# Altium schematic sheet Radar_Digital.SchDoc
size A; SheetNumber: 3; SheetTotal: 4
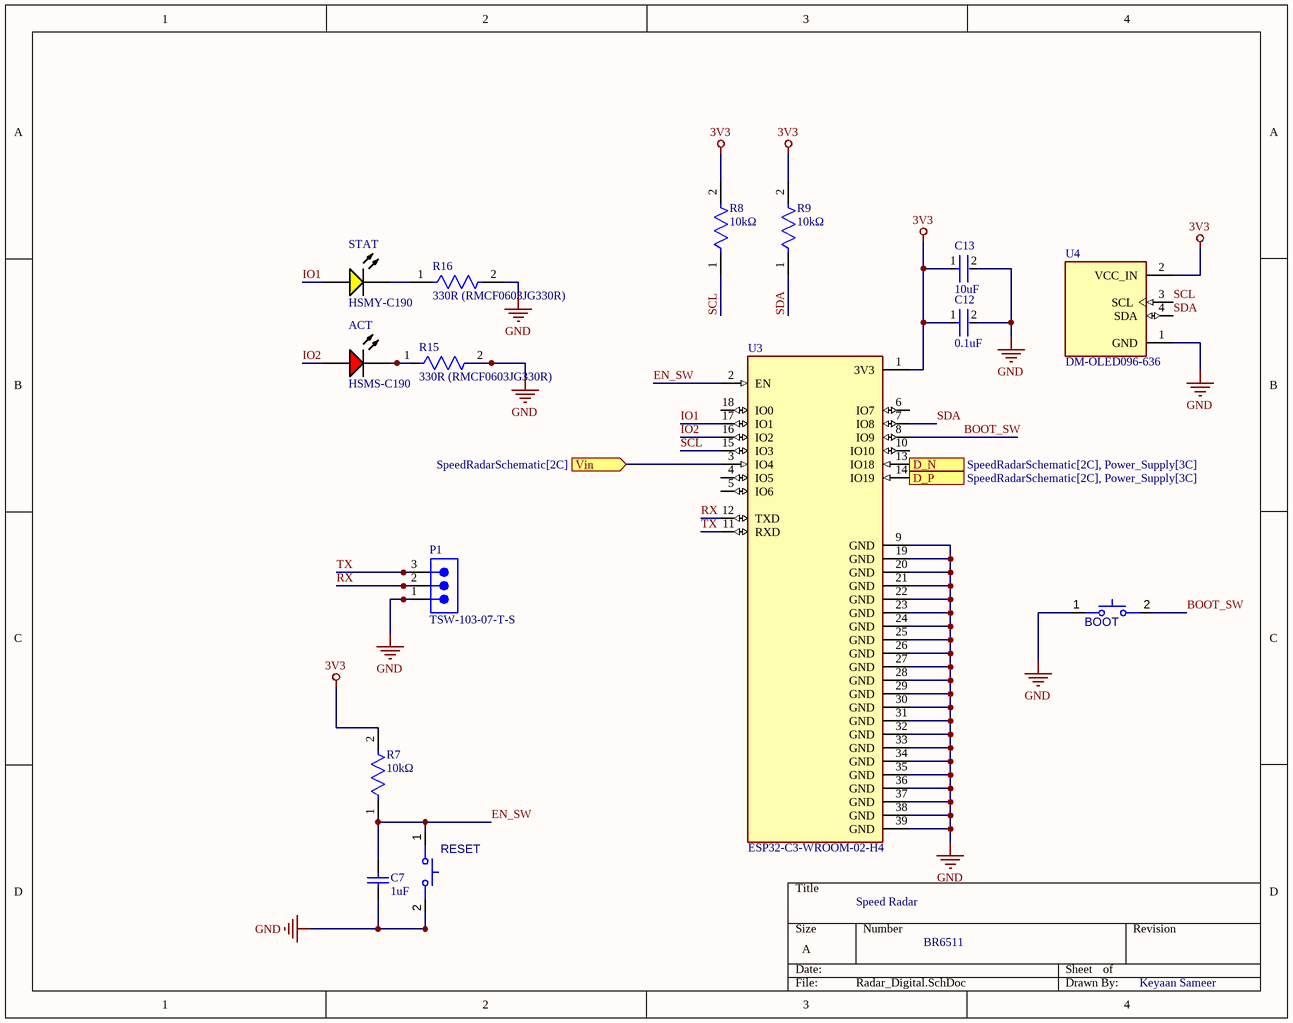
[diagram p0: Radar_Digital.SchDoc]

## Parts
ACT  HSMS-C190  [AVAG-HSMX-C190_V]
BOOT  B3U-1000P-B  [OMRON-B3U-1000P-2-B_V]  (value not drawn)
C7  1uF  [CAPC1608X90X35NL15T15]
C12  value 0.1uF  [FP-GCD21B-0_15-IPC_A]  (hidden comment: GCD21BR71H104KA01L)
C13  10uF  [FP-C0805C106K8RACAUTO-MFG]
P1  TSW-103-07-T-S  [SMTC-TSW-103-07-X-S]
R7  10kΩ  [FP-RQ732B-IPC_C]
R8  10kΩ  [FP-RQ732B-IPC_C]
R9  10kΩ  [FP-RQ732B-IPC_C]
R15  330R (RMCF0603JG330R)  [FP-RMCF0603-IPC_B]
R16  330R (RMCF0603JG330R)  [FP-RMCF0603-IPC_B]
RESET  B3U-1000P-B  [OMRON-B3U-1000P-2-B_V]  (value not drawn)
STAT  HSMY-C190  [AVAG-HSMX-C190_V]
U3  ESP32-C3-WROOM-02-H4  [MODULE_ESP32-C3-WROOM-02-H4]
U4  DM-OLED096-636  [MODULE_DM-OLED096-636]

## Ports
D_N (in, see SpeedRadarSchematic[2C], Power_Supply[3C]), D_P (in, see SpeedRadarSchematic[2C], Power_Supply[3C]), Vin (in, see SpeedRadarSchematic[2C])

## Nets
3V3: C12.1 C13.1 R7.2 R8.2 R9.2 U3.1(3V3) U4.2(VCC_IN)
GND: BOOT.1 C7.1 C12.2 C13.2 P1.1 R15.2 R16.2 RESET.2 U3.9(GND) U3.19(GND) U3.20(GND) U3.21(GND) U3.22(GND) U3.23(GND) U3.24(GND) U3.25(GND) U3.26(GND) U3.27(GND) U3.28(GND) U3.29(GND) U3.30(GND) U3.31(GND) U3.32(GND) U3.33(GND) U3.34(GND) U3.35(GND) U3.36(GND) U3.37(GND) U3.38(GND) U3.39(GND) U4.1(GND)
BOOT_SW: BOOT.2 U3.8(IO9)
D_N: U3.13(IO18) ; port D_N
D_P: U3.14(IO19) ; port D_P
EN_SW: C7.2 R7.1 RESET.1 U3.2(EN)
IO1: STAT.1(A) U3.17(IO1)
IO2: ACT.1(A) U3.16(IO2)
RX: P1.2 U3.12(TXD)
SCL: R8.1 U3.15(IO3) U4.3(SCL)
SDA: R9.1 U3.7(IO8) U4.4(SDA)
TX: P1.3 U3.11(RXD)
Vin: U3.3(IO4) ; port Vin
NetACT_2: ACT.2(K) R15.1
NetR16_1: R16.1 STAT.2(K)

Not connected (* = marked no-connect by the designer): U3 4(IO5) 5(IO6) 6(IO7) 10(IO10) 18(IO0)

## Notes on the sheet
- Speed Radar
- BR6511
- Keyaan Sameer

## Library data of the parts
ACT = CMP-2000-06427-1: LED Uni-Color Red, 52 mW, 20 mA, -40 to 85 degC, 2-Pin SMD, RoHS, Tape and Reel; Manufacturer: Avago; Reverse Voltage: 5V; Viewing Angle: 170deg; High Brightness: No; Lens Type: ColorlessDiffused; DELETED: Compliant; Product Height (mm): 0.8mm; Dominant Wave Length: 626nm; Number of  Elements: 1; Chip Material: GaP; Lum Intensity: 10mcd; Product Length (mm): 1.6mm; Forward Voltage: 2.6V; Power Dissipation: 52W; Shape Type: Rectangular; Forward Current: 25mA; Peak Wavelength: 630nm; Test Current (It): 20mA; Main Category: ChipLED; Lens Dimensions: 1x0.8x0.5mm; Pin Count: 2; Package Reference: HSMX-C190; Mounting Technology: SurfaceMount; Mounting: SurfaceMount; Datasheet URL: http://docs.avagotech.com/docs/AV02-0551EN; Package Type: ChipLed; Operating Temperature Classification: Industrial; Datasheet Version: 03/2012; Operating Temp Range: -40Cto85C; Emitting Color: Red; Rad Hardened: No; Manufacturer URL: http://www.avagotech.com/; Luminous Intensity: 10mcd; Package Description: 2-Pin Surface Mount Device, Body 1.6 x 0.8 mm, Height 0.9 mm; Type: Uni-Color; Packaging: TapeandReel; Product Depth (mm): 0.8mm
BOOT RESET = CMP-011-00011-3: Ultra-small Surface-mounting Tactile Switches with High Contact Reliability, SPST-NO, -25 to 70 degC, 2-Pin SMD, RoHS, Tape and Reel; Voltage Rating: 12V; Current Rating: 50mA; Pins: 2; RoHS Compliant: Details
C7 = CMP-2006-04534-1: Part Number: 0603YD105MAT2A; Manufacturer: AVX Interconnect / Elco
C12 = CMP-001-00087-1: Ceramic Capacitor, Multilayer, Ceramic, 50V, 10% +Tol, 10% -Tol, X7R, 15% TC, 0.1uF, Surface Mount, 0805; Case/Package: 0805; Mounting Technology: Surface Mount; Min Operating Temperature: -55°C; Capacitor Type: Ceramic; Pins: 2; RoHS Compliant: Yes; Max Operating Temperature: 125°C
C13 = CMP-03020-034662-1: CAP CER 10UF 10V X7R 0805; Tolerance: 10%; Case/Package: 0805; Ratings: AEC-Q200; Packaging: Tape and Reel; Voltage Rating: 10V; Max Operating Temperature: 125°C; Min Operating Temperature: -55°C; Case Code (Metric): 2012; Case Code (Imperial): 0805; Mount: Surface Mount; RoHS Compliant: Yes; Capacitance: 10uF
P1 = CMP-1024-00332-1: 0.025" SQ Post Header, Through-hole, Vertical, -55 to 105 degC, 2.54 mm Pitch, 3-Pin, Male, RoHS; Manufacturer: Samtec; Pitch: 2.54 mm; ComponentLink1URL: http://www.samtec.com; ComponentLink3URL: http://www.samtec.com/documents/webfiles/cpdf/TSW-XXX-XX-XXX-X-XX-XXX-MKT.pdf; PartNumber: TSW-103-07-T-S; Mounting Technology: Through-hole; RoHS: True; DatasheetVersion: F-214; PackageVersion: DM, 8/1988; Temperature Range: -55 to 105 degC; ComponentLink2Description: Datasheet; ComponentLink1Description: Manufacturer URL; Orientation: Vertical; PackageReference: TSW-103-07-X-S; ComponentLink3Description: Package Specification; ComponentLink2URL: http://www.samtec.com/documents/webfiles/pdf/TSW_TH.PDF; PackageDescription: .025[0.64] SQ. Post Terminal Strip Assembly
R7-R9 = CMP-03211-005393-1: RQ732B 1206 10KΩ 0.4W 10ppm/°C 0.1% 200V; Manufacturer: TE; Manufacturer Part Number: RQ73C2B10KBTD; Automotive Grade: Grade 0; ComponentLink2URL: https://www.te.com/commerce/DocumentDelivery/DDEController?Action=showdoc&DocId=Data+Sheet%7F1773270-2%7FA%7Fpdf%7FEnglish%7FENG_DS_1773270-2_A.pdf%7F9-2176388-464; Temperature Range Low: -55°C; Power Rating: 0.4W; Voltage Rating: 200V; RoHS: TRUE; ComponentLink2Description: Datasheet; Composition: Thin Film; Temperature Coefficient: 10ppm/°C; Height: 0.75mm; Ipc Land Pattern Name: RESC310160X60; Series: RQ73; Temperature: -55°C to +155°C; Package: RQ732B; Automotive: Yes; Category: Res; Octopart: https://octopart.com/rq73c2b10kbtd-te+connectivity-93910771; Resistance: 10KΩ; Lead Free: Yes; Temperature Range High: +155°C; Device Class L3: Chip SMD Resistors; Tolerance: 0.1%; Device Class L1: Passive Components; Value: 10KΩ; Device Class L2: Resistors
R15 R16 = CMP-26527-007473-1: 330Ω ±5% 0.1W 0603 Thick Film Chip Resistor AEC-Q200 compliant; Max Power Dissipation: 100mW; Temperature Coefficient: 200ppm/°C; Case/Package: 0603; Length: 0.061inch; Tolerance: 5%; Series: RMCF; Width: 0.031inch; Radiation Hardening: No; Packaging: Tape and Reel; Min Operating Temperature: -55°C; RoHS Compliant: Yes; Mount: Surface Mount; Resistor Type: Thick Film; Features: Automotive AEC-Q200; Resistance: 330R; Contact Plating: Tin; Number of Terminations: 2; Max Operating Temperature: 155°C; Height: 0.022inch
STAT = CMP-1744-00003-1: LED Uni-Color Yellow, 65 mW, 20 mA, -40 to 85 degC, 2-Pin SMD, RoHS, Tape and Reel; Tolerance: 1%; Voltage Rating: 50 V; Power Rating: 100 mW; Case\Package: 0603; Resistance: 390 Ohm; Min Operating Temperature: -55 degC; Length: 1.6 mm; ComponentLink3Description: Package Specification; Mount: Surface Mount; PackageReference: HSMX-C190; ComponentLink2Description: Datasheet; DatasheetVersion: Mar-12; Case Code (Metric): 1608; Pins: 2; Package Quantity: 5000; ComponentLink2URL: http://docs.avagotech.com/docs/AV02-0551EN; ComponentLink1Description: Manufacturer URL; RoHSCompliant: true; Packaging: Tape and Reel; PackageDescription: 2-Pin Surface Mount Device, Body 1.6 x 0.8 mm, Height 0.9 mm; REACH SVHC: No SVHC; ComponentLink3URL: http://www.fairchildsemi.com/dwg/MA/MA03D.pdf; Voltage Rating (DC): 50 V; Width: 0.8 mm; ComponentLink1URL: http://www.avagotech.com/; Max Operating Temperature: 155 degC; Case Code (Imperial): 0603; Height: 0.45 mm
U3 = ESP32-C3-WROOM-02-H4: WiFi Modules (802.11) (Engineering Samples) SMD module, ESP32-C3, 4MB SPI flash, PCB antenna, -40 C +105 C; MF: Espressif Systems; SnapEDA_Link: https://www.snapeda.com/parts/ESP32-C3-WROOM-02-H4/Espressif+Systems/view-part/?ref=snap; Package: Package; Value: *; MP: ESP32-C3-WROOM-02-H4; Check_prices: https://www.snapeda.com/parts/ESP32-C3-WROOM-02-H4/Espressif+Systems/view-part/?ref=eda
U4 = DM-OLED096-636: 0.96â€ 128 X 64 MONOCHROME GRAPHIC OLED DISPLAY MODULE - I2C; SnapEDA_Link: https://www.snapeda.com/parts/DM-OLED096-636/Display+Module/view-part/?ref=snap; Package: Package; Value: *; MF: Display Module; MP: DM-OLED096-636; Check_prices: https://www.snapeda.com/parts/DM-OLED096-636/Display+Module/view-part/?ref=eda